# Altium schematic sheet DC309A_Pinout.SchDoc: Pinout
size 558 x 431 mm; DrawnBy: KAVIKANNAN; DocumentNumber: 2; SheetNumber: 2; SheetTotal: 11; PageSetup: Record=PageOptions|CenterHorizontal=True|CenterVertical=True|PrintScale=0.69|XCorrection=1.00|YCorrection=1.00|PrintKind=0|BorderSize=5000000|LeftOffset=0|BottomOffset=0|Orientation=2|PaperLength=1000|PaperWidth=1000|Scale=100|PaperSource=15|PrintQuality=600|MediaType=1|DitherType=10|PaperKind=Letter|PrintScaleMode=1
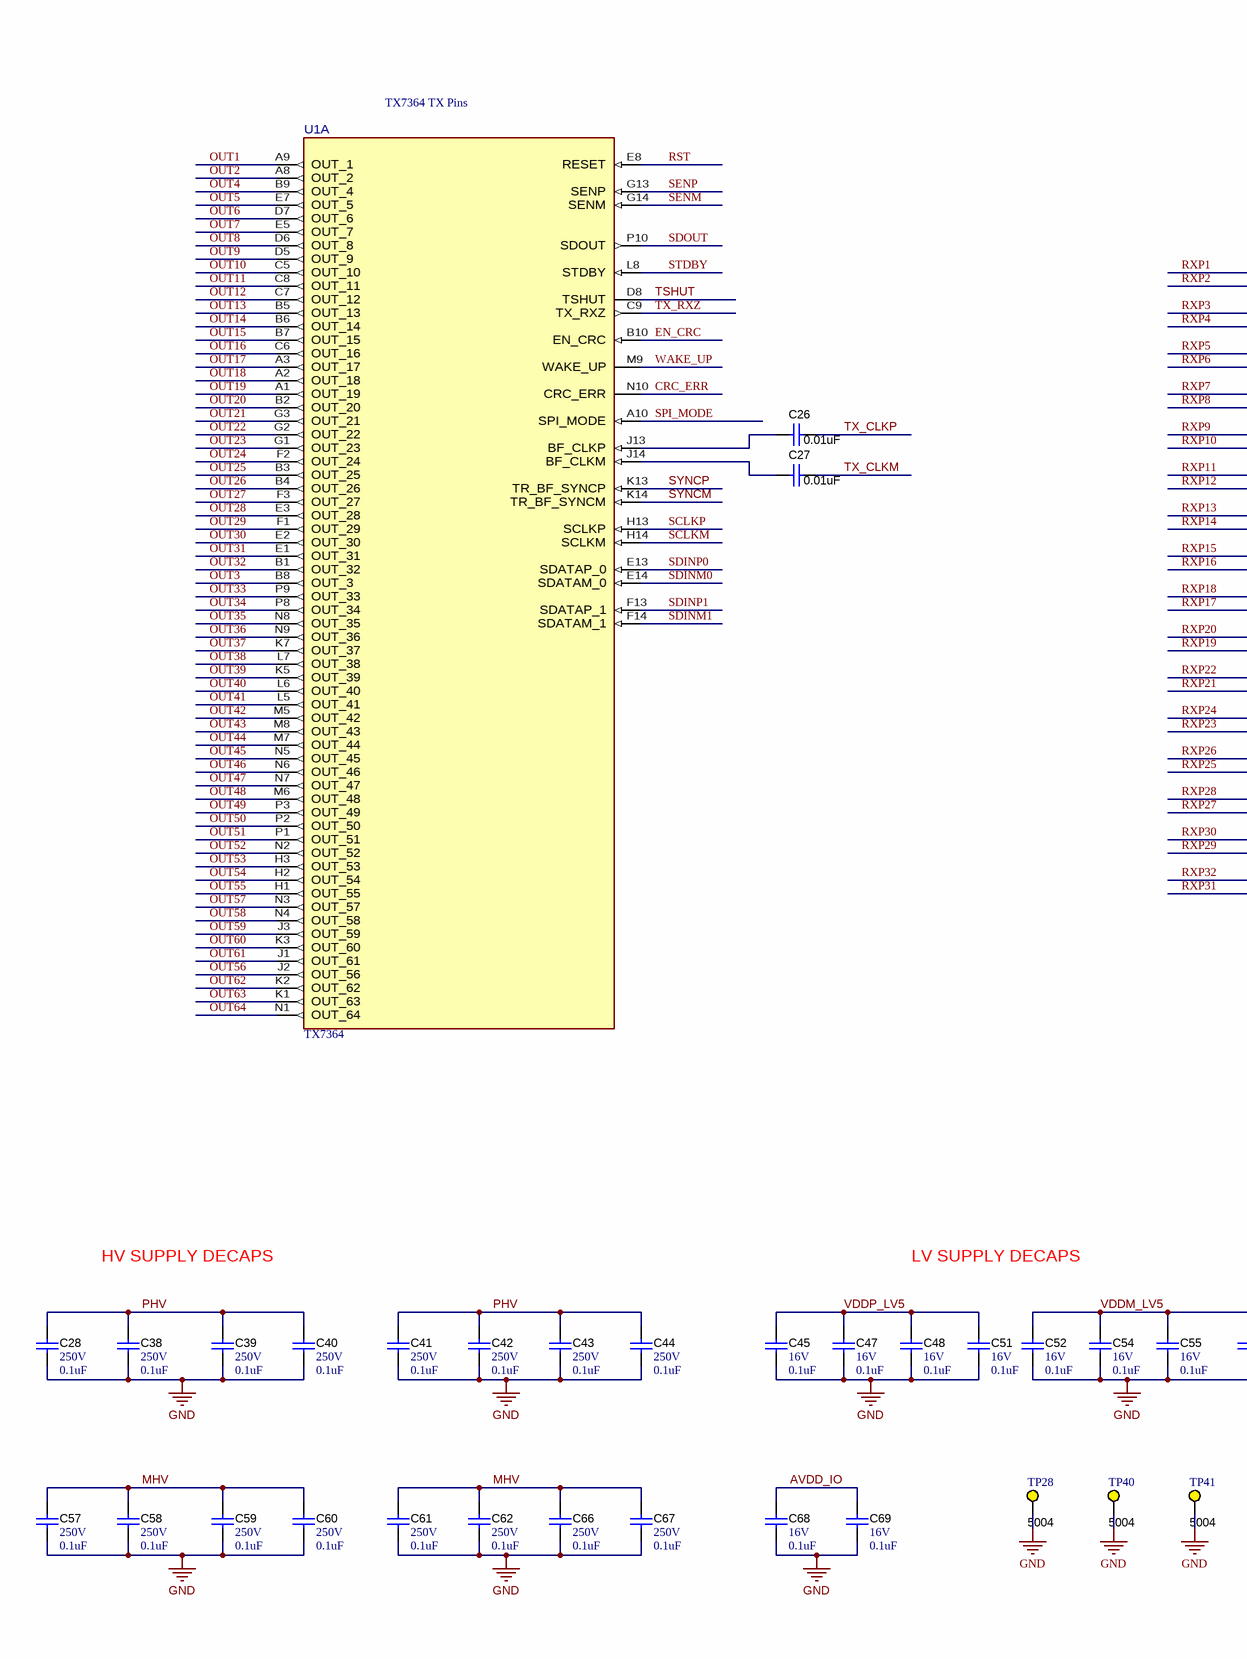
[diagram p0: DC309A_Pinout.SchDoc, left]
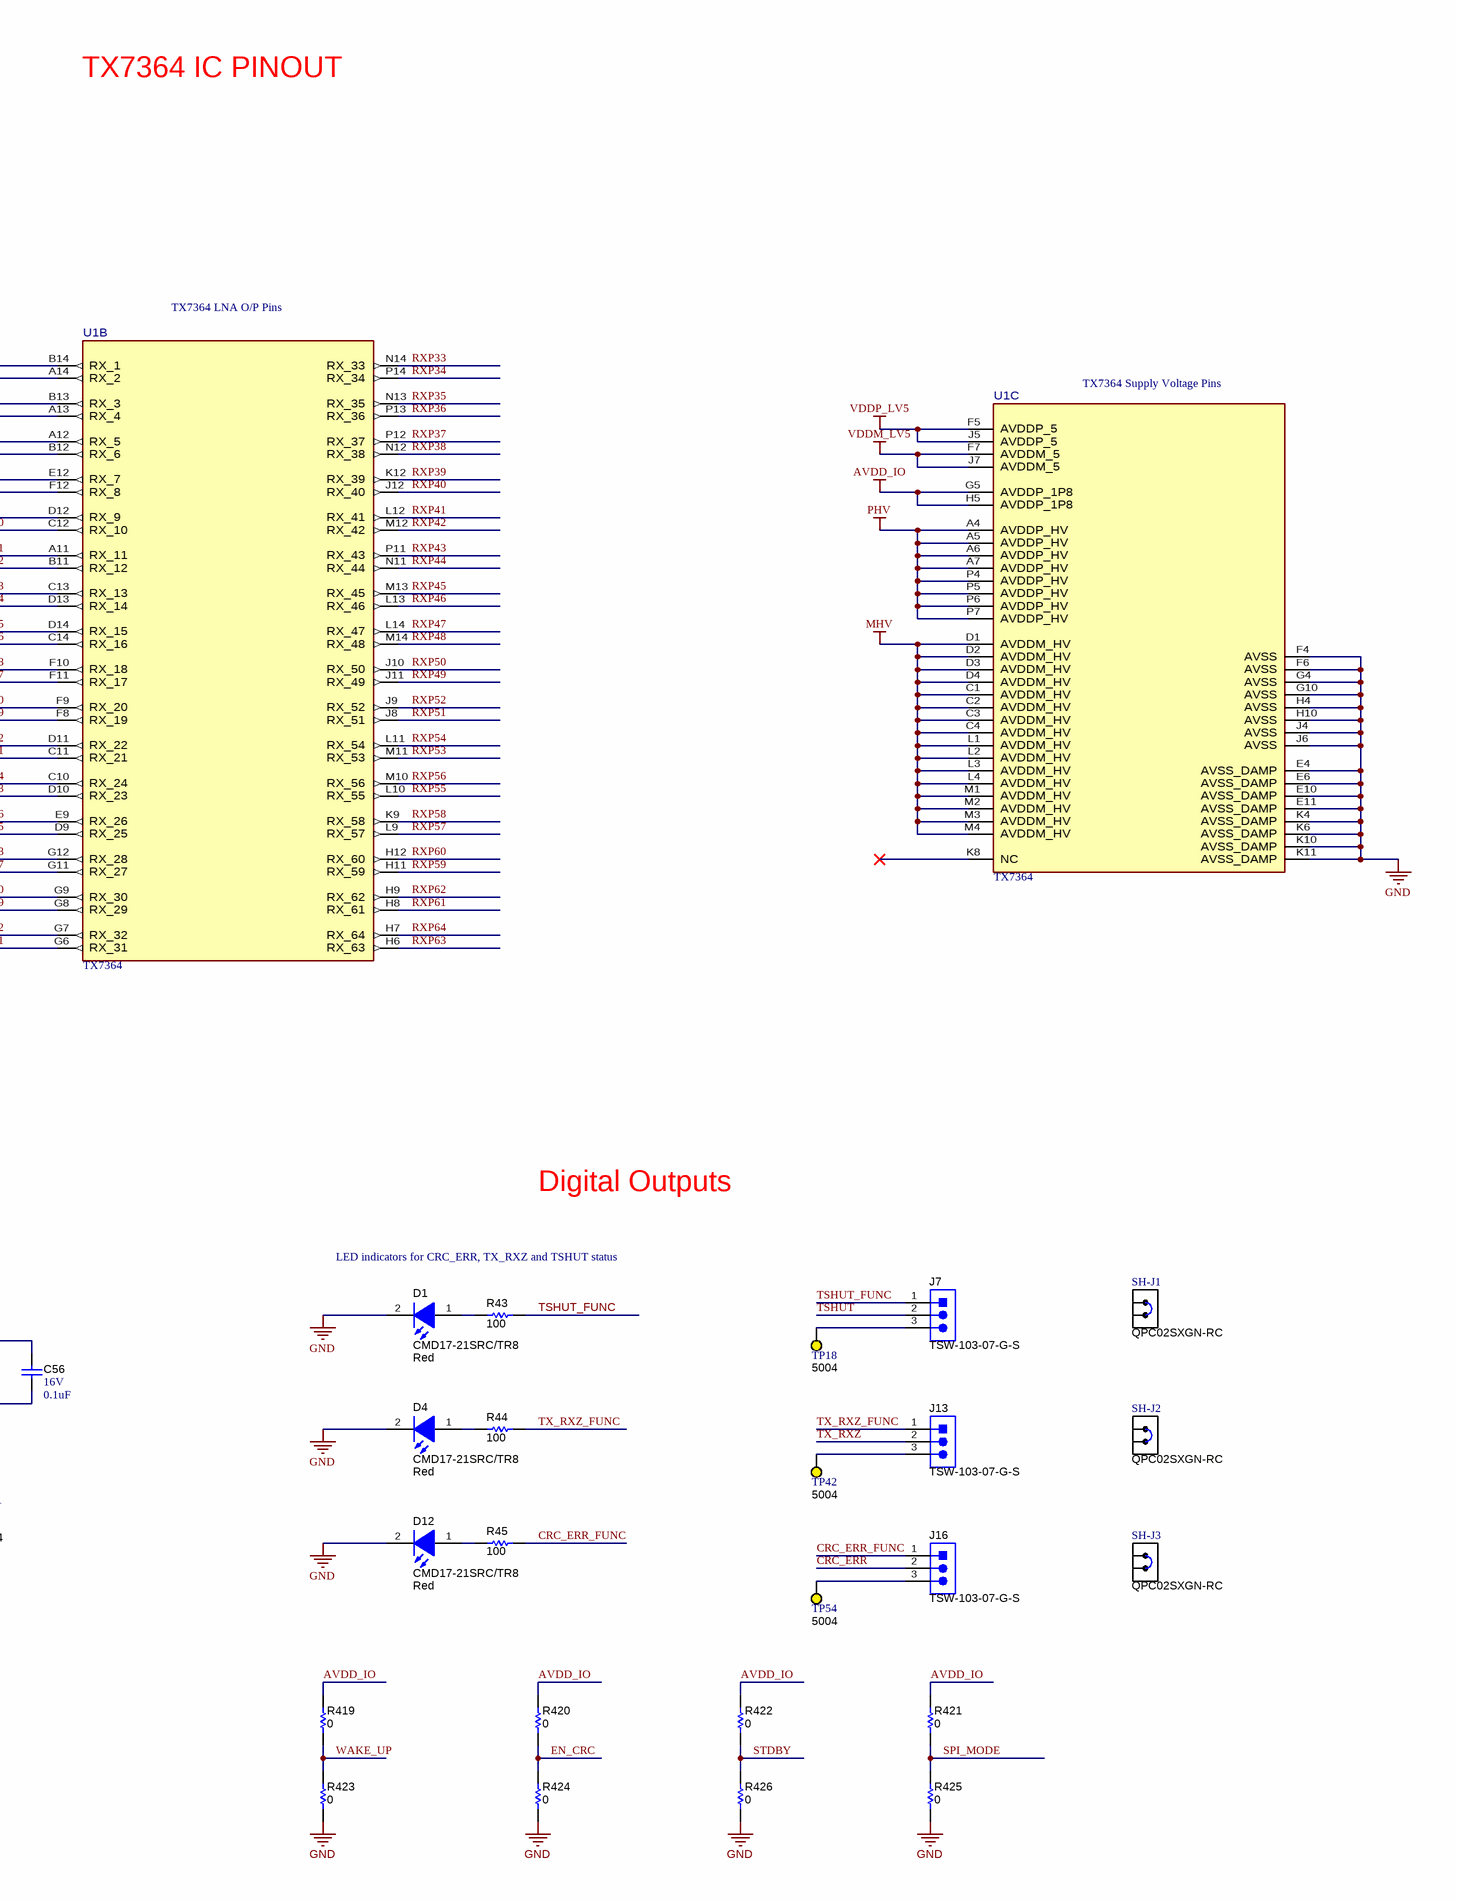
[diagram p1: DC309A_Pinout.SchDoc, right]

## Parts
C26  ValueDisplayed: 0.01uF  [0402_065]  (hidden comment: 520L103KT16T)
C27  ValueDisplayed: 0.01uF  [0402_065]  (hidden comment: 520L103KT16T)
C28  VDC_V: 250V  ValueDisplayed: 0.1uF  [0805_HV]  (hidden comment: C2012X7T2E104K125AA)
C38  VDC_V: 250V  ValueDisplayed: 0.1uF  [0805_HV]  (hidden comment: C2012X7T2E104K125AA)
C39  VDC_V: 250V  ValueDisplayed: 0.1uF  [0805_HV]  (hidden comment: C2012X7T2E104K125AA)
C40  VDC_V: 250V  ValueDisplayed: 0.1uF  [0805_HV]  (hidden comment: C2012X7T2E104K125AA)
C41  VDC_V: 250V  ValueDisplayed: 0.1uF  [0805_HV]  (hidden comment: C2012X7T2E104K125AA)
C42  VDC_V: 250V  ValueDisplayed: 0.1uF  [0805_HV]  (hidden comment: C2012X7T2E104K125AA)
C43  VDC_V: 250V  ValueDisplayed: 0.1uF  [0805_HV]  (hidden comment: C2012X7T2E104K125AA)
C44  VDC_V: 250V  ValueDisplayed: 0.1uF  [0805_HV]  (hidden comment: C2012X7T2E104K125AA)
C45  VDC_V: 16V  ValueDisplayed: 0.1uF  [0201_033]  (hidden comment: C0603X6S1C104K030BC)
C47  VDC_V: 16V  ValueDisplayed: 0.1uF  [0201_033]  (hidden comment: C0603X6S1C104K030BC)
C48  VDC_V: 16V  ValueDisplayed: 0.1uF  [0201_033]  (hidden comment: C0603X6S1C104K030BC)
C51  VDC_V: 16V  ValueDisplayed: 0.1uF  [0201_033]  (hidden comment: C0603X6S1C104K030BC)
C52  VDC_V: 16V  ValueDisplayed: 0.1uF  [0201_033]  (hidden comment: C0603X6S1C104K030BC)
C54  VDC_V: 16V  ValueDisplayed: 0.1uF  [0201_033]  (hidden comment: C0603X6S1C104K030BC)
C55  VDC_V: 16V  ValueDisplayed: 0.1uF  [0201_033]  (hidden comment: C0603X6S1C104K030BC)
C56  VDC_V: 16V  ValueDisplayed: 0.1uF  [0201_033]  (hidden comment: C0603X6S1C104K030BC)
C57  VDC_V: 250V  ValueDisplayed: 0.1uF  [0805_HV]  (hidden comment: C2012X7T2E104K125AA)
C58  VDC_V: 250V  ValueDisplayed: 0.1uF  [0805_HV]  (hidden comment: C2012X7T2E104K125AA)
C59  VDC_V: 250V  ValueDisplayed: 0.1uF  [0805_HV]  (hidden comment: C2012X7T2E104K125AA)
C60  VDC_V: 250V  ValueDisplayed: 0.1uF  [0805_HV]  (hidden comment: C2012X7T2E104K125AA)
C61  VDC_V: 250V  ValueDisplayed: 0.1uF  [0805_HV]  (hidden comment: C2012X7T2E104K125AA)
C62  VDC_V: 250V  ValueDisplayed: 0.1uF  [0805_HV]  (hidden comment: C2012X7T2E104K125AA)
C66  VDC_V: 250V  ValueDisplayed: 0.1uF  [0805_HV]  (hidden comment: C2012X7T2E104K125AA)
C67  VDC_V: 250V  ValueDisplayed: 0.1uF  [0805_HV]  (hidden comment: C2012X7T2E104K125AA)
C68  VDC_V: 16V  ValueDisplayed: 0.1uF  [0201_033]  (hidden comment: C0603X6S1C104K030BC)
C69  VDC_V: 16V  ValueDisplayed: 0.1uF  [0201_033]  (hidden comment: C0603X6S1C104K030BC)
D1  CMD17-21SRC/TR8  value Red  [CMD17-21_Red]
D4  CMD17-21SRC/TR8  value Red  [CMD17-21_Red]
D12  CMD17-21SRC/TR8  value Red  [CMD17-21_Red]
J7  TSW-103-07-G-S  [TSW-103-07-G-S]
J13  TSW-103-07-G-S  [TSW-103-07-G-S]
J16  TSW-103-07-G-S  [TSW-103-07-G-S]
R43  ValueDisplayed: 100  [0402]  (hidden comment: Resistor)
R44  ValueDisplayed: 100  [0402]  (hidden comment: Resistor)
R45  ValueDisplayed: 100  [0402]  (hidden comment: Resistor)
R419  Res_ohm: 0  [0402]  (hidden comment: Resistor)
R420  Res_ohm: 0  [0402]  (hidden comment: Resistor)
R421  Res_ohm: 0  [0402]  (hidden comment: Resistor)
R422  Res_ohm: 0  [0402]  (hidden comment: Resistor)
R423  Res_ohm: 0  [0402]  (hidden comment: Resistor)
R424  Res_ohm: 0  [0402]  (hidden comment: Resistor)
R425  Res_ohm: 0  [0402]  (hidden comment: Resistor)
R426  Res_ohm: 0  [0402]  (hidden comment: Resistor)
SH-J1  QPC02SXGN-RC  [FP-QPC02SXGN-RC_JUMPER-MFG]
SH-J2  QPC02SXGN-RC  [FP-QPC02SXGN-RC_JUMPER-MFG]
SH-J3  QPC02SXGN-RC  [FP-QPC02SXGN-RC_JUMPER-MFG]
TP18  5004  [Keystone5004]
TP28  5004  [Keystone5004]
TP40  5004  [Keystone5004]
TP41  5004  [Keystone5004]
TP42  5004  [Keystone5004]
TP54  5004  [Keystone5004]
U1  TX7364  [ACP0196A-MFG]  (parts A,B,C of 3)

## Nets
AVDD_IO: C68.1 C69.1 R419.2 R420.2 R421.2 R422.2 U1.G5(AVDDP_1P8) U1.H5(AVDDP_1P8)
GND: C28.2 C38.2 C39.2 C40.2 C41.2 C42.2 C43.2 C44.2 C45.2 C47.2 C48.2 C51.2 C52.2 C54.2 C55.2 C56.2 C57.2 C58.2 C59.2 C60.2 C61.2 C62.2 C66.2 C67.2 C68.2 C69.2 D1.2(K) D4.2(K) D12.2(K) R423.1 R424.1 R425.1 R426.1 TP28.1 TP40.1 TP41.1 U1.E4(AVSS_DAMP) U1.E6(AVSS_DAMP) U1.E10(AVSS_DAMP) U1.E11(AVSS_DAMP) U1.F4(AVSS) U1.F6(AVSS) U1.G4(AVSS) U1.G10(AVSS) U1.H4(AVSS) U1.H10(AVSS) U1.J4(AVSS) U1.J6(AVSS) U1.K4(AVSS_DAMP) U1.K6(AVSS_DAMP) U1.K10(AVSS_DAMP) U1.K11(AVSS_DAMP)
MHV: C57.1 C58.1 C59.1 C60.1 C61.1 C62.1 C66.1 C67.1 U1.C1(AVDDM_HV) U1.C2(AVDDM_HV) U1.C3(AVDDM_HV) U1.C4(AVDDM_HV) U1.D1(AVDDM_HV) U1.D2(AVDDM_HV) U1.D3(AVDDM_HV) U1.D4(AVDDM_HV) U1.L1(AVDDM_HV) U1.L2(AVDDM_HV) U1.L3(AVDDM_HV) U1.L4(AVDDM_HV) U1.M1(AVDDM_HV) U1.M2(AVDDM_HV) U1.M3(AVDDM_HV) U1.M4(AVDDM_HV)
PHV: C28.1 C38.1 C39.1 C40.1 C41.1 C42.1 C43.1 C44.1 U1.A4(AVDDP_HV) U1.A5(AVDDP_HV) U1.A6(AVDDP_HV) U1.A7(AVDDP_HV) U1.P4(AVDDP_HV) U1.P5(AVDDP_HV) U1.P6(AVDDP_HV) U1.P7(AVDDP_HV)
VDDM_LV5: C52.1 C54.1 C55.1 C56.1 U1.F7(AVDDM_5) U1.J7(AVDDM_5)
VDDP_LV5: C45.1 C47.1 C48.1 C51.1 U1.F5(AVDDP_5) U1.J5(AVDDP_5)
CRC_ERR: J16.2 U1.N10(CRC_ERR)
CRC_ERR_FUNC: J16.1 R45.1
EN_CRC: R420.1 R424.2 U1.B10(EN_CRC)
OUT1: U1.A9(OUT_1)
OUT2: U1.A8(OUT_2)
OUT3: U1.B8(OUT_3)
OUT4: U1.B9(OUT_4)
OUT5: U1.E7(OUT_5)
OUT6: U1.D7(OUT_6)
OUT7: U1.E5(OUT_7)
OUT8: U1.D6(OUT_8)
OUT9: U1.D5(OUT_9)
OUT10: U1.C5(OUT_10)
OUT11: U1.C8(OUT_11)
OUT12: U1.C7(OUT_12)
OUT13: U1.B5(OUT_13)
OUT14: U1.B6(OUT_14)
OUT15: U1.B7(OUT_15)
OUT16: U1.C6(OUT_16)
OUT17: U1.A3(OUT_17)
OUT18: U1.A2(OUT_18)
OUT19: U1.A1(OUT_19)
OUT20: U1.B2(OUT_20)
OUT21: U1.G3(OUT_21)
OUT22: U1.G2(OUT_22)
OUT23: U1.G1(OUT_23)
OUT24: U1.F2(OUT_24)
OUT25: U1.B3(OUT_25)
OUT26: U1.B4(OUT_26)
OUT27: U1.F3(OUT_27)
OUT28: U1.E3(OUT_28)
OUT29: U1.F1(OUT_29)
OUT30: U1.E2(OUT_30)
OUT31: U1.E1(OUT_31)
OUT32: U1.B1(OUT_32)
OUT33: U1.P9(OUT_33)
OUT34: U1.P8(OUT_34)
OUT35: U1.N8(OUT_35)
OUT36: U1.N9(OUT_36)
OUT37: U1.K7(OUT_37)
OUT38: U1.L7(OUT_38)
OUT39: U1.K5(OUT_39)
OUT40: U1.L6(OUT_40)
OUT41: U1.L5(OUT_41)
OUT42: U1.M5(OUT_42)
OUT43: U1.M8(OUT_43)
OUT44: U1.M7(OUT_44)
OUT45: U1.N5(OUT_45)
OUT46: U1.N6(OUT_46)
OUT47: U1.N7(OUT_47)
OUT48: U1.M6(OUT_48)
OUT49: U1.P3(OUT_49)
OUT50: U1.P2(OUT_50)
OUT51: U1.P1(OUT_51)
OUT52: U1.N2(OUT_52)
OUT53: U1.H3(OUT_53)
OUT54: U1.H2(OUT_54)
OUT55: U1.H1(OUT_55)
OUT56: U1.J2(OUT_56)
OUT57: U1.N3(OUT_57)
OUT58: U1.N4(OUT_58)
OUT59: U1.J3(OUT_59)
OUT60: U1.K3(OUT_60)
OUT61: U1.J1(OUT_61)
OUT62: U1.K2(OUT_62)
OUT63: U1.K1(OUT_63)
OUT64: U1.N1(OUT_64)
RST: U1.E8(RESET)
RXP1: U1.B14(RX_1)
RXP2: U1.A14(RX_2)
RXP3: U1.B13(RX_3)
RXP4: U1.A13(RX_4)
RXP5: U1.A12(RX_5)
RXP6: U1.B12(RX_6)
RXP7: U1.E12(RX_7)
RXP8: U1.F12(RX_8)
RXP9: U1.D12(RX_9)
RXP10: U1.C12(RX_10)
RXP11: U1.A11(RX_11)
RXP12: U1.B11(RX_12)
RXP13: U1.C13(RX_13)
RXP14: U1.D13(RX_14)
RXP15: U1.D14(RX_15)
RXP16: U1.C14(RX_16)
RXP17: U1.F11(RX_17)
RXP18: U1.F10(RX_18)
RXP19: U1.F8(RX_19)
RXP20: U1.F9(RX_20)
RXP21: U1.C11(RX_21)
RXP22: U1.D11(RX_22)
RXP23: U1.D10(RX_23)
RXP24: U1.C10(RX_24)
RXP25: U1.D9(RX_25)
RXP26: U1.E9(RX_26)
RXP27: U1.G11(RX_27)
RXP28: U1.G12(RX_28)
RXP29: U1.G8(RX_29)
RXP30: U1.G9(RX_30)
RXP31: U1.G6(RX_31)
RXP32: U1.G7(RX_32)
RXP33: U1.N14(RX_33)
RXP34: U1.P14(RX_34)
RXP35: U1.N13(RX_35)
RXP36: U1.P13(RX_36)
RXP37: U1.P12(RX_37)
RXP38: U1.N12(RX_38)
RXP39: U1.K12(RX_39)
RXP40: U1.J12(RX_40)
RXP41: U1.L12(RX_41)
RXP42: U1.M12(RX_42)
RXP43: U1.P11(RX_43)
RXP44: U1.N11(RX_44)
RXP45: U1.M13(RX_45)
RXP46: U1.L13(RX_46)
RXP47: U1.L14(RX_47)
RXP48: U1.M14(RX_48)
RXP49: U1.J11(RX_49)
RXP50: U1.J10(RX_50)
RXP51: U1.J8(RX_51)
RXP52: U1.J9(RX_52)
RXP53: U1.M11(RX_53)
RXP54: U1.L11(RX_54)
RXP55: U1.L10(RX_55)
RXP56: U1.M10(RX_56)
RXP57: U1.L9(RX_57)
RXP58: U1.K9(RX_58)
RXP59: U1.H11(RX_59)
RXP60: U1.H12(RX_60)
RXP61: U1.H8(RX_61)
RXP62: U1.H9(RX_62)
RXP63: U1.H6(RX_63)
RXP64: U1.H7(RX_64)
SCLKM: U1.H14(SCLKM)
SCLKP: U1.H13(SCLKP)
SDINM0: U1.E14(SDATAM_0)
SDINM1: U1.F14(SDATAM_1)
SDINP0: U1.E13(SDATAP_0)
SDINP1: U1.F13(SDATAP_1)
SDOUT: U1.P10(SDOUT)
SENM: U1.G14(SENM)
SENP: U1.G13(SENP)
SPI_MODE: R421.1 R425.2 U1.A10(SPI_MODE)
STDBY: R422.1 R426.2 U1.L8(STDBY)
SYNCM: U1.K14(TR_BF_SYNCM)
SYNCP: U1.K13(TR_BF_SYNCP)
TSHUT: J7.2 U1.D8(TSHUT)
TSHUT_FUNC: J7.1 R43.1
TX_CLKM: C27.2
TX_CLKP: C26.2
TX_RXZ: J13.2 U1.C9(TX_RXZ)
TX_RXZ_FUNC: J13.1 R44.1
WAKE_UP: R419.1 R423.2 U1.M9(WAKE_UP)
NetC26_1: C26.1 U1.J13(BF_CLKP)
NetC27_1: C27.1 U1.J14(BF_CLKM)
NetD1_1: D1.1(A) R43.2
NetD4_1: D4.1(A) R44.2
NetD12_1: D12.1(A) R45.2
NetJ7_3: J7.3 TP18.1
NetJ13_3: J13.3 TP42.1
NetJ16_3: J16.3 TP54.1

Not connected (* = marked no-connect by the designer): U1 K8(NC)*

## Notes on the sheet
- TX7364 IC PINOUT
- TX7364 TX Pins
- TX7364 LNA O/P Pins
- (near U1) TX7364 Supply Voltage Pins
- LED indicators for CRC_ERR, TX_RXZ and TSHUT status
- Digital Outputs
- HV SUPPLY DECAPS
- LV SUPPLY DECAPS
- Drawn By:
- SVN Rev:
- Number:
- TID #:
- Orderable:
- Rev:
- Sheet Title:
- File:
- Project Title:
- Designed for:
- Assembly Variant:
- Mod. Date:
- Sheet:
- Size:
- of
- C
- http://www.ti.com
- Texas Instruments and/or its licensors do not warrant the accuracy or completeness of this specification or any information contained therein. Texas Instruments and/or its licensors do not warrant that this design will meet the specifications, will be suitable for your application or fit for any particular purpose, or will operate in an implementation. Texas Instruments and/or its licensors do not warrant that the design is production worthy. You should completely validate and test your design implementation to confirm the system functionality for your application.
- Engineer:
- Contact:
- © Texas Instruments

## Library data of the parts
C26 C27 = CMP-0006210-2: CAP, CERM, 0.01 uF, 16 V, +/- 10%, X7R, 0402; Manufacturer: AT Ceramics; TaMin_C: -55°C; Polarized: N; SizeAreaWB_mm2: 3; Value1: Unknown; U/M: EA; Value: 0.01uF; TaMax_C: 125°C; SizeZ_mm: 0.65; SizeX_mm: 1; SizeY_mm: 0.5; Cap_Case: 0402; Value2: 16V; CompType: Capacitor; Cap_F: 10nF; AEC Category: Q200; Supplier Part Number 2: 581-520L103KT16T; Publisher: Texas Instruments; Supplier 2: Mouser; TempCo: X7R; Published: 2008-06-19; RoHS: Y; MountType: SMT; Supplier 1: Digi-Key; PackageReference: 0402; Tolerance_%: 10%; SizeArea_mm2: 0.5; LatestRevisionDate: 2017-03-09; PartNumber: 520L103KT16T; AEC Qualified: N; VDC_V: 16V; ComponentLink1Description: Datasheet link; AEC Grade: N/A; Supplier Part Number 1: 1284-1540-1-ND; Technology: Ceramic; ComponentLink1URL: https://www.atceramics.com/UserFiles/520l.pdf
C28 C38-C44 C57-C62 C66 C67 = CMP-0007897-1: CAP, CERM, 0.1 uF, 250 V, +/- 10%, X7T, 0805; Manufacturer: TDK; TaMin_C: -55°C; Polarized: N; SizeAreaWB_mm2: 6.75; Value1: Unknown; U/M: EA; Value: 0.1uF; TaMax_C: 125°C; SizeZ_mm: 1.45; SizeX_mm: 2; SizeY_mm: 1.25; Cap_Case: 0805; SizeArea_mm2: 2.5; Cap_F: 100nF; AEC Category: Q200; ComponentLink1URL: http://product.tdk.com/en/catalog/spec/mlccspec_commercial_general_midvoltage_en.pdf; Supplier Part Number 2: 51T2714; Publisher: Texas Instruments; Supplier 2: Newark; Supplier Part Number 3: 810-C2012X7T2E104KAA; TempCo: X7T; Supplier 3: Mouser; Published: 2008-06-19; RoHS: Y; MountType: SMT; Supplier 1: Digi-Key; PackageReference: 0805; Tolerance_%: 10%; Value2: 250V; CompType: Capacitor; LatestRevisionDate: 2017-03-09; PartNumber: C2012X7T2E104K125AA; AEC Qualified: N; ComponentLink1Description: Datasheet link; AEC Grade: N/A; Supplier Part Number 1: 445-7749-1-ND; Technology: Ceramic
C45 C47 C48 C51 C52 C54-C56 C68 C69 = CMP-0009637-3: CAP, CERM, 0.1 uF, 16 V, +/- 10%, X6S, 0201; Manufacturer: TDK; TaMin_C: -55°C; Polarized: N; SizeAreaWB_mm2: 2.08; Value1: Unknown; U/M: EA; Value: 0.1uF; TaMax_C: 105°C; SizeZ_mm: 0.33; SizeX_mm: 0.6; SizeY_mm: 0.3; Cap_Case: 0201; SizeArea_mm2: 0.18; Cap_F: 100nF; AEC Category: Q200; ComponentLink1URL: http://product.tdk.com/en/catalog/datasheets/mlcc_commercial_general_en.pdf; Supplier Part Number 2: 17X8592; Publisher: Texas Instruments; Supplier 2: Newark; Supplier Part Number 3: 810-C0603X6S1C104KBC; TempCo: X6S; Supplier 3: Mouser; Published: 2008-06-19; RoHS: Y; MountType: SMT; Supplier 1: Digi-Key; PackageReference: 0201; Tolerance_%: 10%; Value2: 16V; CompType: Capacitor; LatestRevisionDate: 2017-03-09; PartNumber: C0603X6S1C104K030BC; AEC Qualified: N; ComponentLink1Description: Datasheet link; AEC Grade: N/A; Supplier Part Number 1: 445-15903-1-ND; Technology: Ceramic
D1 D4 D12 = CMP-0084855-1: LED, Red, SMD; Manufacturer: Visual Communications Company, LLC; SizeX_mm: 2; SizeArea_mm2: 2.5; SizeAreaWB_mm2: 6.75; Angle: 140; Value2: 1.7V; Ir_A: 100µA; Value1: 0.1W; SizeY_mm: 1.25; Io_A: 20mA; Tjmax_C: 85°C; Power_TotalModule: 100mW; SizeZ_mm: 1.2; Vr_V: 5V; ComponentLink1URL: https://vcclite.com/wp-content/uploads/wpallimport/files/files/CMD1721Seriesver3.pdf; ComponentLink1Description: Datasheet link; PackageReference: 2x1.25mm; Color: Red; PartNumber: CMD17-21SRC/TR8; Vf_V: 1.7V; RoHS: Y; MountType: SMT; Type: ?; CompType: LED
J7 J13 J16 = CMP-0075407-2: Header, 100mil, 3x1, Gold, TH; Manufacturer: Samtec; Pitch_mm: 2.54; Cert_VDE: N; Gender: Male; Cert_CSA: Y; Voltage_V: 550V; Green_REACh: Passed; Current_A: 6.3A; Green_Lifecycle: Active; Row_Count: 1; ComponentLink1Description: Datasheet URL; RoHS: Y; Supplier 1: Digi-Key; Cert_UL: Y; Orientation: Vertical; Green_EU RoHS: Passed; PackageReference: 3x1 Header; Color: Black; PartNumber: TSW-103-07-G-S; PinCount: 3; ContactFinish: Gold; Cert_CULUS: N; Shrouded: N; ClassName: Header; ComponentLink1URL: http://samtec.com/ftppub/pdf/TSW_TH.PDF; CompType: Header; MountType: TH; Supplier Part Number 1: SAM1029-03-ND; Green_EU RoHS-2: Passed
R43-R45 = CMP-0026993-2: RES, 100, 5%, 0.1 W, AEC-Q200 Grade 0, 0402; PartNumber: ERJ-2GEJ101X; Manufacturer: Panasonic; Value: 100; Value_Code: 100R; Power_W: 100mW; Value2: 0.1W; TempCo: 200 ppm/C; SizeArea_mm2: 0.5; SizeX_mm: 1; SizeZ_mm: 0.6; EIA_Code: E24; U/M: EA; AEC Category: Q200; AEC Qualified: Y; AEC Grade: 0; CompType: Resistor; PackageReference: 0402; RoHS: Y; Res_ohm: 100; Tolerance_%: 5%; Value1: 5%; MountType: SMT; Technology: Thick Film; SizeY_mm: 0.5; Published: 2008-06-26; Publisher: Texas Instruments; LatestRevisionDate: 2017-03-09; ComponentLink1Description: Datasheet link; ComponentLink1URL: https://industrial.panasonic.com/cdbs/www-data/pdf/RDA0000/AOA0000C84.pdf; Supplier 1: Digi-Key; Supplier Part Number 1: P100JCT-ND; Supplier 2: Newark; Supplier Part Number 2: 65T8246; Supplier 3: Farnell; Supplier Part Number 3: 2059210
R419-R426 = CMP-0026992-3: RES, 0, 5%, 0.1 W, AEC-Q200 Grade 0, 0402; PartNumber: ERJ-2GE0R00X; Manufacturer: Panasonic; Value_Code: 0000; Power_W: 100mW; Value2: 0.1W; VDC_V: 50V; TempCo: 600 ppm/C; SizeArea_mm2: 0.5; SizeX_mm: 1; SizeZ_mm: 0.6; EIA_Code: E24; AEC Category: Q200; AEC Qualified: Y; SizeAreaWB_mm2: 3; CompType: Resistor; PackageReference: 0402; RoHS: Y; Tolerance_%: 5%; Value1: 5%; MountType: SMT; Technology: Thick Film; SizeY_mm: 0.5; ComponentLink1Description: Datasheet link; ComponentLink1URL: https://industrial.panasonic.com/cdbs/www-data/pdf/RDA0000/AOA0000C301.pdf; Supplier 1: Digi-Key; Supplier Part Number 1: P0.0JCT-ND; Supplier 2: Newark; Supplier Part Number 2: 65T8307; Supplier 3: Mouser; Supplier Part Number 3: 667-ERJ-2GE0R00X; AEC Grade: 0; ValueDisplayed: 0
SH-J1-SH-J3 = CMP-0087961-2: CONN JUMPER S2 (1 x 2) Position Shunt Connector Black Open Top 0.100" (2.54mm) GoldHORTING .100" GOLD; Manufacturer: Sullins; Current_A: 3A; Symbol Name: SYM-QPC02SXGN-RC; RoHS: TRUE; PackageReference: JUMPER; PartNumber: QPC02SXGN-RC; ContactFinish: Gold; ComponentLink1URL: https://s3.amazonaws.com/catalogspreads-pdf/PAGE128-129%20.100%20JUMPER.pdf; ComponentLink1Description: Datasheet; PinCount: 2
TP18 TP28 TP40-TP42 TP54 = CMP-0055141-2: Test Point, Miniature, Yellow, TH; Manufacturer: Keystone Electronics; CT: TRUE; ContactFinish: Silver; Green_Lifecycle: Active; CNHeader: FALSE; Green_REACh: Passed; Supplier 2: Mouser; RoHS: Y; Publisher: Texas Instruments; PackageReference: Yellow Miniature Testpoint; CompType: Test Point; Green_EU RoHS: Passed; Color: Yellow; PartNumber: 5004; Green_EU RoHS-2: Incomplete; LatestRevisionDate: 26/05/2017; Supplier 1: Digi-Key; Supplier Part Number 1: 36-5004-ND; Supplier Part Number 2: 534-5004; MountType: TH; ComponentLink1URL: http://www.keyelco.com/userAssets/file/M60-2p60.pdf; ComponentLink1Description: Datasheet URL
U1 = CMP-0096492-3: Manufacturer: Texas Instruments; CompType: IC; AEC Category: Q200; Standoff Height: 0.293mm; SizeZ_mm: 1.321mm; ComponentLink1Description: Datasheet Link; Part Number: TX7364; PartNumber: TX7364; ComponentLink2URL: http://www.ti.com/product/GPN; Operating Temperature Range: to; ComponentLink3URL: http://www.ti.com/product/GPN/datasheet; Datasheet Path: datasheets/IC-TX7364.pdf; ComponentLink3Description: Online Datasheet; ComponentLink1URL: http://www.ti.com/lit/ds/symlink/GPN.pdf; ComponentLink2Description: Product Folder; helpURL: https://upverter.com/upn/revision/116a209f64e0270f/; PackageReference: FCBGA196; RoHS: UNKNOWN; PartId: 1